# EAGLE design led_controller (EAGLE 7.4.0)
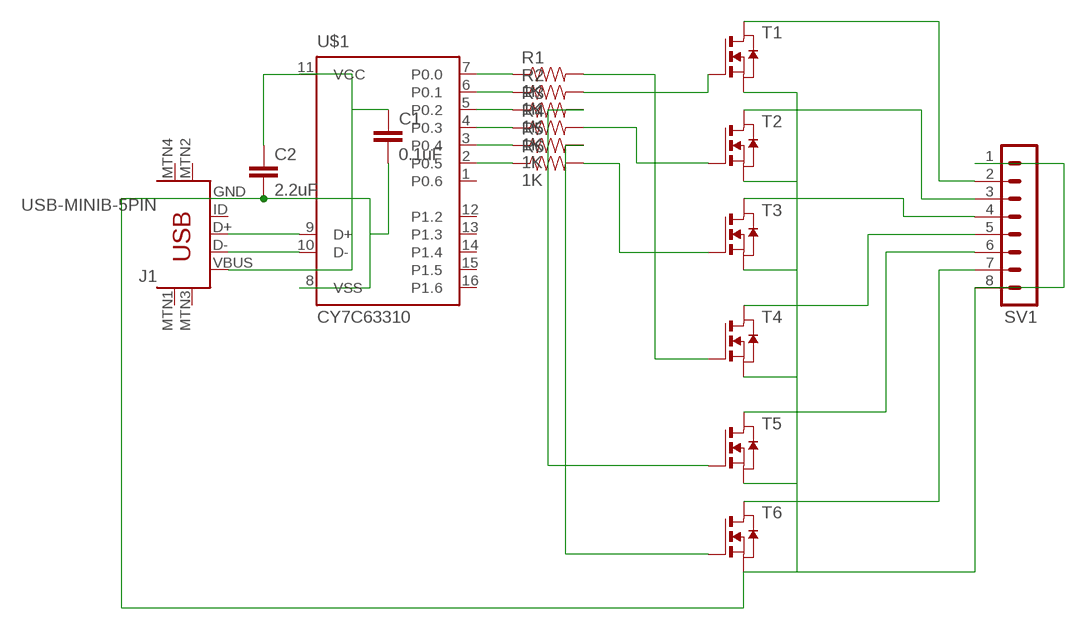
[diagram p0: schematic, sheet 1]

## Parts
C1  0.1uF  0.1UF-25V-5%(0603)  [0603-CAP]
C2  2.2uF  2.2UF-25V-+80/-20(0805)  [0805-CAP]
J1  USB-MINIB-5PIN  [USB-MINIB]
R1  1K  1KOHM-1/10W-1%(0603)  [0603-RES]
R2  1K  1KOHM-1/10W-1%(0603)  [0603-RES]
R3  1K  1KOHM-1/10W-1%(0603)  [0603-RES]
R4  1K  1KOHM-1/10W-1%(0603)  [0603-RES]
R5  1K  1KOHM-1/10W-1%(0603)  [0603-RES]
R6  1K  1KOHM-1/10W-1%(0603)  [0603-RES]
SV1  MA08-1  [MA08-1]
T1  NMOSSOT223  [SOT223]
T2  NMOSSOT223  [SOT223]
T3  NMOSSOT223  [SOT223]
T4  NMOSSOT223  [SOT223]
T5  NMOSSOT223  [SOT223]
T6  NMOSSOT223  [SOT223]
U$1  CY7C63310  [SOIC16]

## Nets
N$1: J1.D+ U$1.9(D+)
N$2: J1.D- U$1.10(D-)
N$3: C1.1 C2.1 J1.VBUS U$1.11(VCC)
N$4: C1.2 C2.2 J1.GND SV1.1 SV1.8 T1.3(S) T2.3(S) T3.3(S) T4.3(S) T5.3(S) T6.3(S) U$1.8(VSS)
N$5: R6.1 U$1.2(P0.5)
N$6: R5.1 U$1.3(P0.4)
N$7: R4.1 U$1.4(P0.3)
N$8: R3.1 U$1.5(P0.2)
N$9: R2.1 U$1.6(P0.1)
N$10: R1.1 U$1.7(P0.0)
N$11: R6.2 T3.1(G)
N$12: R5.2 T6.1(G)
N$13: R4.2 T2.1(G)
N$14: R3.2 T5.1(G)
N$15: R2.2 T1.1(G)
N$16: R1.2 T4.1(G)
N$18: SV1.2 T1.2(D) T1.4(D)
N$19: SV1.3 T2.2(D) T2.4(D)
N$20: SV1.4 T3.2(D) T3.4(D)
N$21: SV1.5 T4.2(D) T4.4(D)
N$22: SV1.6 T5.2(D) T5.4(D)
N$23: SV1.7 T6.2(D) T6.4(D)
Unconnected: J1.ID J1.MTN1(MTN2) J1.MTN2(MTN3) J1.MTN3(MTN1) J1.MTN4 U$1.1(P0.6) U$1.12(P1.2) U$1.13(P1.3) U$1.14(P1.4) U$1.15(P1.5) U$1.16(P1.6)

## Library data of the parts
C1 = SparkFun-Capacitors:0.1UF-25V-5%(0603): CAP-08604; PROD_ID: CAP-08604
C2 = SparkFun-Capacitors:2.2UF-25V-+80/-20(0805): CAP-11624; PROD_ID: CAP-11624
J1 = SparkFun-Connectors:USB-MINIB: Mini-USB "B" connector with 5th pin broken out. Created new symbol breaking out 5th "ID" pin in mini/micro USB connector spec. See: http://en.wikipedia.org/wiki/Mini_usb#Cables. Uses same footprint as 4-pin symbol. Also added pins to connect to mounting / shield pads if required (probably not generally needed as signals aren't shielded once they leave the connector).; PROD_ID: CONN-08193
R1-R6 = SparkFun-Resistors:1KOHM-1/10W-1%(0603): RES-07856; PROD_ID: RES-07856
SV1 = con-lstb:MA08-1: PIN HEADER; OC_FARNELL: unknown; OC_NEWARK: unknown
T1-T6 = zetex:NMOSSOT223: MOS FET; OC_FARNELL: unknown; OC_NEWARK: unknown
U$1 = cypress:CY7C63310

## Board
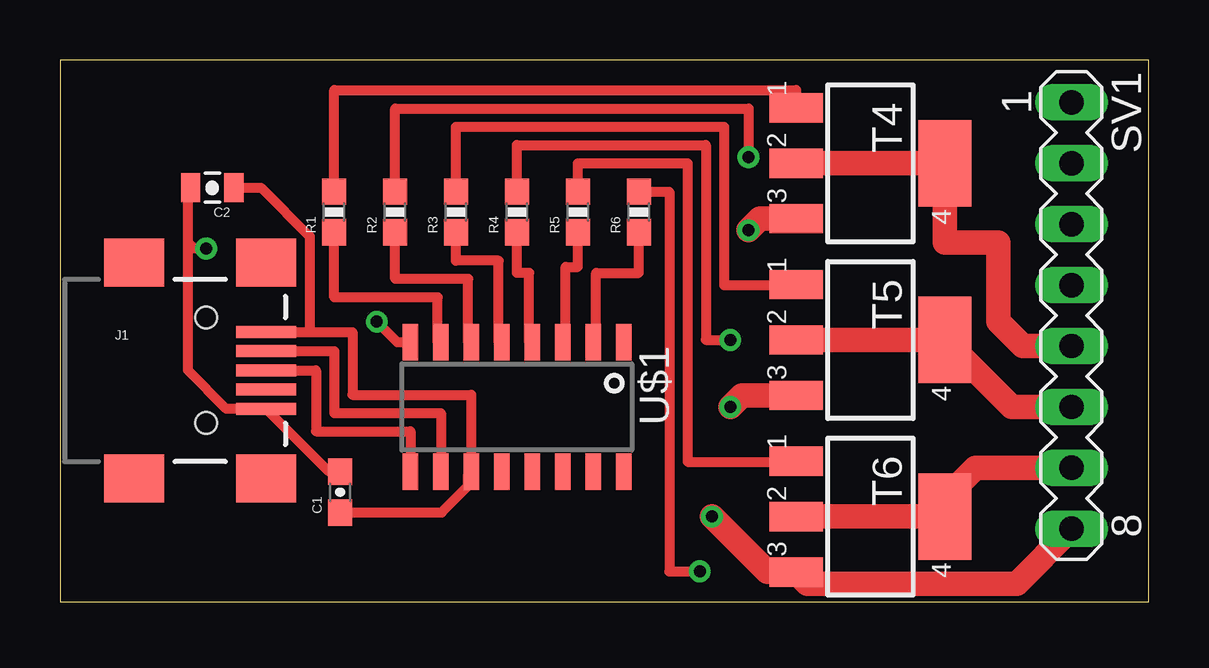
[diagram p1: board, top side]
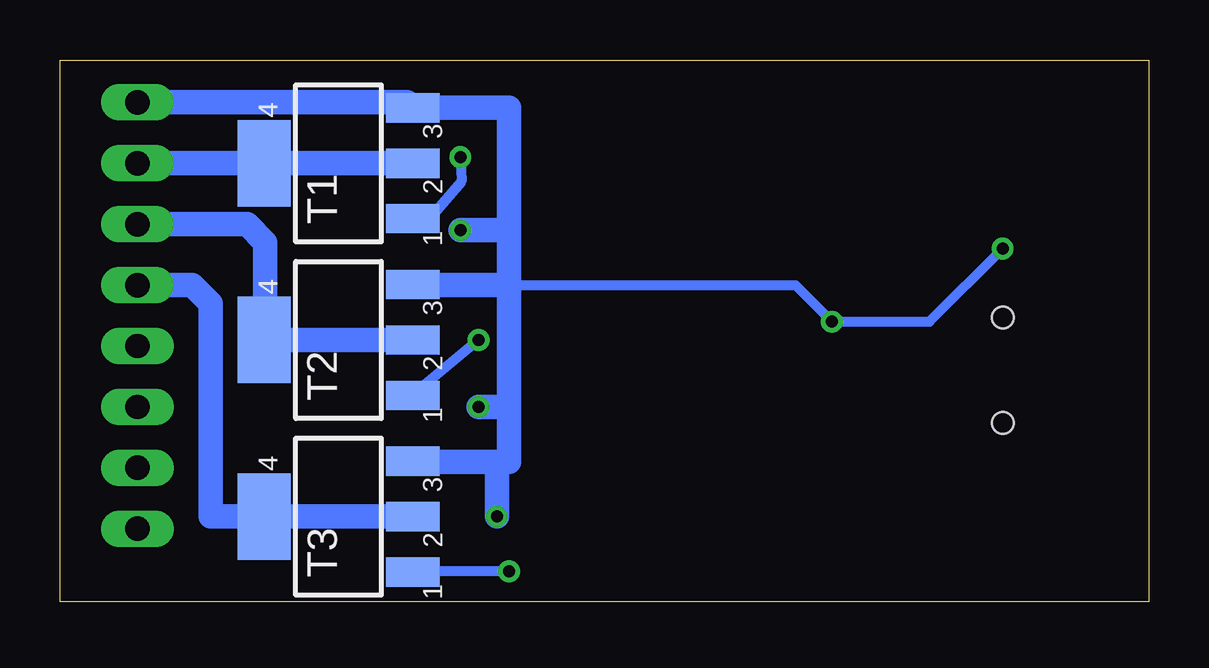
[diagram p2: board, bottom side, seen from below]

Size 45.39 x 22.6 mm. Coordinates in mm from the lower left corner, seen from the top.
Outline: 0,0 45.39,0 45.39,22.6 0,22.6 0,0
Copper layers (1*16): Top 0.035mm / dielectric 1.5mm / Bottom 0.035mm
Design rules "default": minimum track width 10mil, minimum drill 24mil, track to track 8mil, track to pad 8mil, pad to pad 8mil, via to via 8mil, smd to smd 8mil, copper to edge 40mil, drill to drill 8mil, minimum pad ring 10mil, minimum via ring 8mil, stop-mask expansion 4mil, vias tented up to drill 0mil, thermal gap 10mil

### Footprints (pad centres in the part's own frame; a part is rotated, then mirrored left to right if it is on the bottom)
0603-CAP = smd 1.1 x 1: 1 -0.85,0; 2 0.85,0
0805-CAP = smd 0.8 x 1.2: 1 -0.9,0; 2 0.9,0
USB-MINIB = smd 2.5 x 0.5: D+ 2.5,0; D- 2.5,0.8; GND 2.5,-1.6; ID 2.5,-0.8; VBUS 2.5,1.6 | smd 2.5 x 2: MTN1 -3,4.5; MTN2 2.5,4.5; MTN3 -3,-4.5; MTN4 2.5,-4.5 | hole 0.9: 0,2.2; 0,-2.2
0603-RES = smd 1.1 x 1: 1 -0.85,0; 2 0.85,0
MA08-1 = drill 1.016 long: 1 -8.89,0; 2 -6.35,0; 3 -3.81,0; 4 -1.27,0; 5 1.27,0; 6 3.81,0; 7 6.35,0; 8 8.89,0
SOT223 = smd 1.219 x 2.235: 1 -2.311,-3.099; 2 0,-3.099; 3 2.311,-3.099 | smd 3.6 x 2.2: 4 0,3.099
SOIC16 = smd 0.635 x 1.524: 1 -4.445,-2.695; 2 -3.175,-2.695; 3 -1.905,-2.695; 4 -0.635,-2.695; 5 0.635,-2.695; 6 1.905,-2.695; 7 3.175,-2.695; 8 4.445,-2.695; 9 4.445,2.695; 10 3.175,2.695; 11 1.905,2.695; 12 0.635,2.695; 13 -0.635,2.695; 14 -1.905,2.695; 15 -3.175,2.695; 16 -4.445,2.695

### Placement (x,y rotation side)
C1  11.68,4.57 90 top
C2  6.35,17.27 180 top
J1  6.1,9.65 0 top
R1  11.43,16.26 90 top
R2  13.97,16.26 90 top
R3  16.51,16.26 90 top
R4  19.05,16.26 90 top
R5  21.59,16.26 90 top
R6  24.13,16.26 90 top
SV1  42.16,11.94 270 top
T1  33.78,18.29 90 bottom
T2  33.78,10.92 90 bottom
T3  33.78,3.56 90 bottom
T4  33.78,18.29 270 top
T5  33.78,10.92 270 top
T6  33.78,3.56 270 top
U$1  19.05,8.13 180 top

### Tracks (layer width: path | path; a pad name or v marks a point on that pad's centre or on a via)
N$1
  Top 0.406: J1.D+ 10.67,9.65 10.67,7.11 14.61,7.11 U$1.9
N$2
  Top 0.406: J1.D- 11.43,10.45 11.43,7.87 15.88,7.87 U$1.10
N$3
  Top 0.406: J1.VBUS 10.41,11.25 | 10.41,11.25 12.19,11.25 12.19,8.64 17.14,8.64 U$1.11 17.02,5.31 17.02,4.83 15.91,3.72 C1.1 | C2.1 8.38,17.27 10.41,15.24 10.41,11.25
N$4  (via drill 0.5)
  Top 0.406: 5.33,14.99 5.33,9.65 6.93,8.05 J1.GND 11.23,5.42 C1.2 | 5.33,14.99 5.33,17.16 C2.2 | U$1.8 14.07,10.82 v13.21,11.68 | v6.1,14.73 5.59,14.73 5.33,14.99
  Top 1.016: v27.18,3.56 29.49,1.25 T6.3 31.17,0.76 39.88,0.76 SV1.8 | T5.3 28.42,8.61 v27.94,8.13 | T4.3 29.18,15.98 v28.7,15.49
  Bottom 0.406: v6.1,14.73 9.14,11.68 v13.21,11.68 14.73,13.21 26.67,13.21
  Bottom 1.016: 26.67,15.49 26.67,20.6 T1.3 30.91,20.83 SV1.1 | 26.67,15.49 26.67,13.21 | 26.67,13.21 30.68,13.21 T2.3 | 26.67,13.21 26.67,8.38 | 26.67,8.38 26.67,5.84 27.43,5.84 | 27.43,5.84 30.68,5.84 T3.3 | v27.18,3.56 27.18,5.59 27.43,5.84 | v27.94,8.13 26.92,8.13 26.67,8.38 | v28.7,15.49 26.67,15.49
N$5
  Top 0.406: U$1.2 22.35,10.82 22.35,13.72 24.13,13.72 R6.1
N$6
  Top 0.406: U$1.3 21.08,10.82 21.08,13.97 21.59,13.97 R5.1
N$7
  Top 0.406: U$1.4 19.56,10.82 19.56,13.72 19.05,13.72 R4.1
N$8
  Top 0.406: U$1.5 18.29,10.82 18.29,14.22 16.51,14.22 R3.1
N$9
  Top 0.406: U$1.6 17.02,10.82 17.02,13.46 13.97,13.46 R2.1
N$10
  Top 0.406: U$1.7 15.75,10.82 15.75,12.7 11.43,12.7 R1.1
N$11  (via drill 0.5)
  Top 0.406: R6.2 25.4,17.11 25.4,1.27 v26.67,1.27
  Bottom 0.406: v26.67,1.27 30.68,1.27 T3.1
N$12
  Top 0.406: R5.2 21.59,18.29 26.16,18.29 26.16,5.84 30.68,5.84 T6.1
N$13  (via drill 0.5)
  Top 0.406: R4.2 19.05,19.05 26.92,19.05 26.92,10.92 v27.94,10.92
  Bottom 0.406: v27.94,10.92 30.68,8.64 T2.1
N$14
  Top 0.406: R3.2 16.51,19.81 27.69,19.81 27.69,13.21 30.68,13.21 T5.1
N$15  (via drill 0.5)
  Top 0.406: R2.2 13.97,20.57 28.7,20.57 v28.7,18.54
  Bottom 0.406: v28.7,18.54 28.65,17.53 29.97,16 29.97,15.98 T1.1
N$16
  Top 0.406: R1.2 11.43,21.34 30.68,21.34 T4.1
N$18
  Bottom 1.016: T1.2 T1.4 SV1.2
N$19
  Bottom 1.016: T2.2 T2.4 36.83,10.92 36.83,14.99 37.59,15.75 SV1.3
N$20
  Bottom 1.016: T3.2 T3.4 39.12,3.56 39.12,12.45 39.88,13.21 SV1.4
N$21
  Top 1.016: SV1.5 40.13,10.67 39.12,11.68 39.12,14.99 36.88,14.99 T4.4 T4.2
N$22
  Top 1.016: T5.2 T5.4 39.67,8.13 SV1.6
N$23
  Top 1.016: 36.88,4.83 36.88,4.32 | 36.88,4.32 T6.4 T6.2 | SV1.7 38.15,5.59 36.88,4.32